# Altium schematic sheet Controls.SchDoc
size A; SheetNumber: 2; SheetTotal: 9
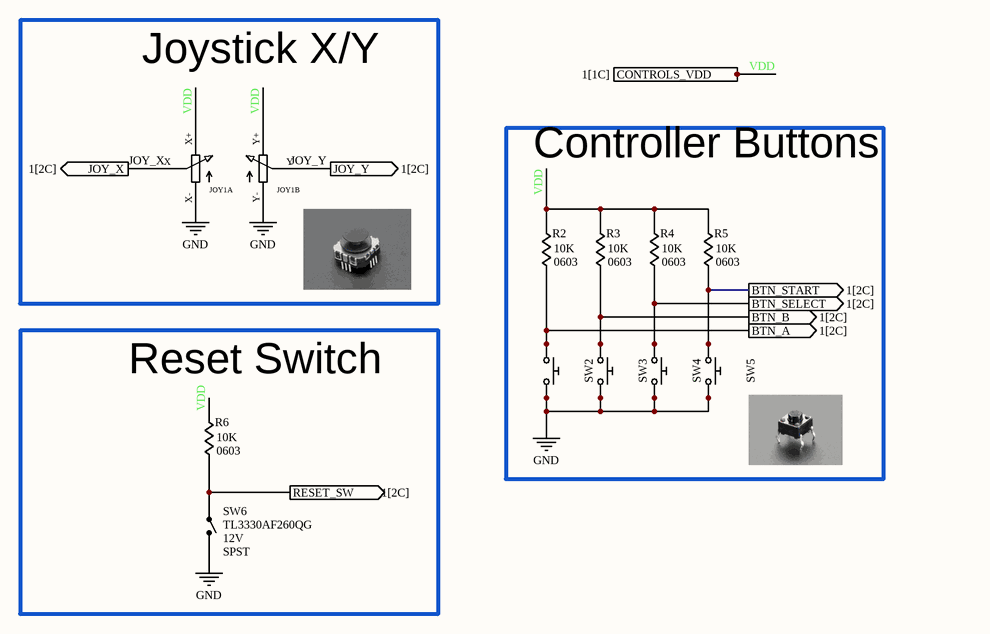
[diagram p0: Controls.SchDoc]

## Parts
JOY1  CTRL-JOYSTICK_ANALOG_XY  [PCB-JOYSTICK-ANALOG_MINITHM]  (value not drawn)  (parts A,B of 2)
R2  value 10K  Footprint: 0603  [PCB-RES-SMD-0603]  (hidden comment: RES-SMD-0603)
R3  value 10K  Footprint: 0603  [PCB-RES-SMD-0603]  (hidden comment: RES-SMD-0603)
R4  value 10K  Footprint: 0603  [PCB-RES-SMD-0603]  (hidden comment: RES-SMD-0603)
R5  value 10K  Footprint: 0603  [PCB-RES-SMD-0603]  (hidden comment: RES-SMD-0603)
R6  value 10K  Footprint: 0603  [PCB-RES-SMD-0603]  (hidden comment: RES-SMD-0603)
SW2  SWITCH-SMD-SMT-6MM  [PCB-SMD-SWITCH-6MM]  (value not drawn)
SW3  SWITCH-SMD-SMT-6MM  [PCB-SMD-SWITCH-6MM]  (value not drawn)
SW4  SWITCH-SMD-SMT-6MM  [PCB-SMD-SWITCH-6MM]  (value not drawn)
SW5  SWITCH-SMD-SMT-6MM  [PCB-SMD-SWITCH-6MM]  (value not drawn)
SW6  Voltage Rating (DC): 12V  Throw Configuration: SPST  Part Number: TL3330AF260QG  [PCB-SPST-TACTILE-RA]  (hidden comment: SWITCH-SPST-TACT-RA)

## Blocks framed on the sheet
Joystick X/Y: JOY1
Controller Buttons: R2-R5 SW2-SW5
Reset Switch: R6 SW6

## Ports
BTN_A (out, see 1[2C]), BTN_B (out, see 1[2C]), BTN_SELECT (out, see 1[2C]), BTN_START (out, see 1[2C]), CONTROLS_VDD (in, see 1[1C]), JOY_X (out, see 1[2C]), JOY_Y (out, see 1[2C]), RESET_SW (out, see 1[2C])

## Nets
GND: JOY1.X-(A) JOY1.Y-(A) SW2.B(S) SW2.B'(S1) SW3.B(S) SW3.B'(S1) SW4.B(S) SW4.B'(S1) SW5.B(S) SW5.B'(S1) SW6.2(S)
BTN_A: R2.1 SW2.A(P) SW2.A'(P1) ; port BTN_A
BTN_B: R3.1 SW3.A(P) SW3.A'(P1) ; port BTN_B
BTN_SELECT: R4.1 SW4.A(P) SW4.A'(P1) ; port BTN_SELECT
BTN_START: R5.1 SW5.A(P) SW5.A'(P1) ; port BTN_START
JOY_X: JOY1.X(S) ; port JOY_X
JOY_Y: JOY1.Y(S) ; port JOY_Y
RESET_SW: R6.1 SW6.1(P) ; port RESET_SW
VDD: JOY1.X+(E) JOY1.Y+(E) R2.2 R3.2 R4.2 R5.2 R6.2 ; port CONTROLS_VDD
NetSW6_MT1: SW6.MT1(MT) SW6.MT2(MT)

## Library data of the parts
JOY1 = CMP-069-000000-7: 2-Axis analog joystick
R2-R6 = CMP-00002-4: Generic (no part number) 0603 surface mount resistor
SW2-SW5 = CMP-067-000001-3: 6mm diameter tactile switch.; SymbolName_1: BUTTON_4PIN; GateName_1: G$1; DeviceSetName: SWITCH_TACT_SMT; DeviceName: _6MM8MMCAP; LibraryName: Adafruit PyGamer; Design Item ID: SWITCH_TACT_SMT_6MM8MMCAP; Source: Adafruit PyGamer.SCHLIB; Pin Count: 4; Component Type: Standard
SW6 = CMP-067-000003-2: Switch Tactile N.O. SPST Rectangular Button Gull Wing 0.05A 12VDC 2.55N SMD; Actuator Material: Nylon,Polyamide; Mechanical Life: 30000Cycles; Switch Travel: 0.25mm; Actuator Length: 1mm; Contact Resistance: 100mR; Operating Force: 260gf; Current Rating: 50mA; Switch Function: Off-Mom; Illumination Type: Non-Illuminated; Contact Material: Silver; Termination: Gull Wing; RoHS Compliant: Yes; Max Voltage Rating (DC): 12V; Mounting Technology: Surface Mount; Contact Plating: Silver; Series: TL3330; Electrical Life: 30000Cycles; Orientation: Right Angle; Min Operating Temperature: -20°C; Lead Free: Lead Free; Size: 3.4mm; Color: Black; Packaging: Tape and Reel; Case/Package: SMD/SMT; Package Quantity: 2300; Max Operating Temperature: 70°C